# EAGLE schematic H03R0-T (EAGLE 9.6.2)
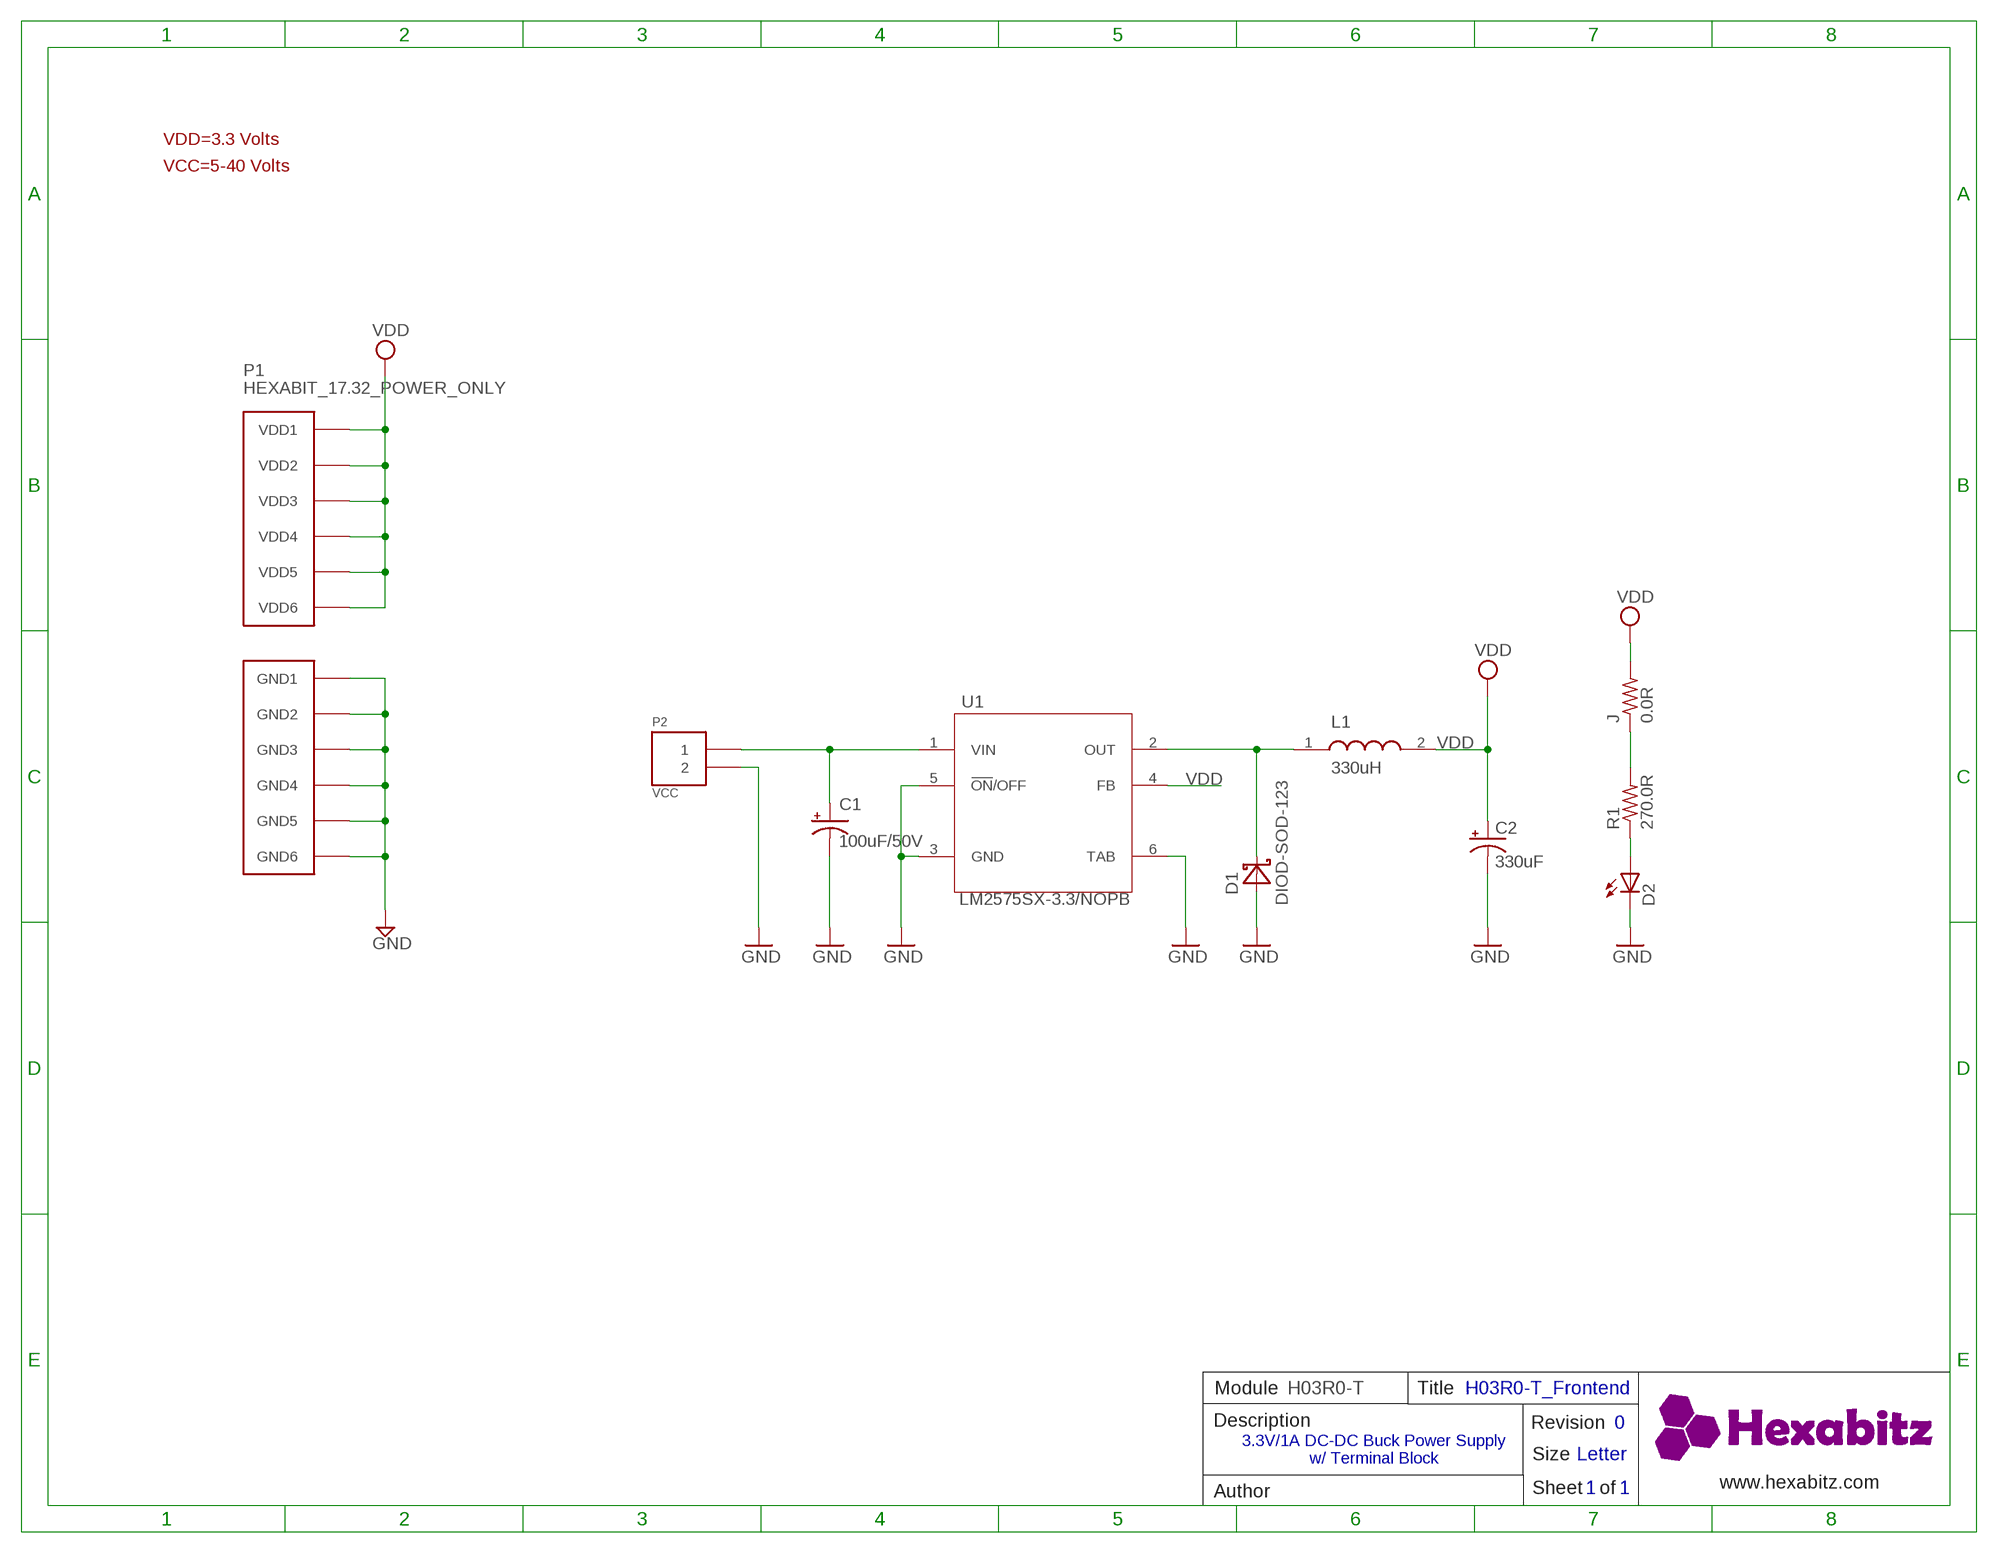
[diagram p0: schematic, sheet 1]

## Parts
C1  100uF/50V  CPOL-US  [E3,5-8]
C2  330uF  AVX-E  [CAPPM7343X200N]
D1  DIOD-SOD-123  [SOD123]
D2  VLMS1300-GS08  [VLMS1300-GS08]
J  0.0R  R-0603  [R-0603]
L1  330uH  SRR1280-331K  [SRR1280-150M]
P1  HEXABIT_17.32_POWER_ONLY  [HEXABIT_17.32_POWER_ONLY]
P2  VCC  1546111-2  [1546111-2]
R1  270.0R  R-0603  [R-0603]
U1  LM2575SX-3.3/NOPB  [TO170P1435X457-6N]

## Nets
GND: C1.- C2.2(-) D1.1(A) D2.C P1.PAD_PD7(GND1) P1.PAD_PD8(GND2) P1.PAD_PD9(GND3) P1.PAD_PD10(GND4) P1.PAD_PD11(GND5) P1.PAD_PD12(GND6) P2.2 U1.3(GND) U1.5(ON/OFF) U1.6(TAB)
N$1: C1.+ P2.1 U1.1(VIN)
N$2: D1.2(C) L1.1 U1.2(OUT)
N$3: D2.A R1.1
N$4: J.1 R1.2
VDD: C2.1(+) J.2 L1.2 P1.PAD_PU7(VDD1) P1.PAD_PU8(VDD2) P1.PAD_PU9(VDD3) P1.PAD_PU10(VDD4) P1.PAD_PU11(VDD5) P1.PAD_PU12(VDD6) U1.4(FB)

## Notes on the sheet
- VDD=3.3 Volts
- VCC=5-40 Volts
- Module | H03R0-T | Title | H03R0-T_Frontend
- Description | Revision | 0
- 3.3V/1A DC-DC Buck Power Supply
  w/ Terminal Block
- Size | Letter
- www.hexabitz.com
- Author | Sheet   of | 1 | 1
- C:/Users/Admin/Desktop/logodraft.bmp | C:/Users/Admin/Desktop/logodraft.bmp

## Library data of the parts
C1 = Hexabitz:CPOL-US: ELECTROLYTIC CAPACITOR grid 3.5 mm, diameter 8 mm; CAPACITANCE: 100F; CPACITANCE_RATING: ±20%; MFN: Nichicon; MPN: UVR1H101MPD1TD; OCTOPART_ID: 913e58b97f3b4ef9; OCTOPART_URL: http://octopart.com/uvr1h101mpd1td-nichicon-9292643; VOLTAGE_RATING_DC: 50.0 V
C2 = Hexabitz:AVX-E: Panasonic 330F SMD Solid Polymer Tantalum Capacitor, 6.3 V 20%, POSCAP Series Source: Datasheet <https://industrial.panasonic.com/cdbs/www-data/pdf/AAA8000/AAA8000C68.pdf>; DESCRIPTION: Panasonic 330F SMD Solid Polymer Tantalum Capacitor, 6.3 V 20%, POSCAP Series; HEIGHT: 2mm; MANUFACTURER_NAME: Panasonic; MANUFACTURER_PART_NUMBER: 6TPC330MA; MOUSER_PART_NUMBER: 667-6TPC330MA; MOUSER_PRICE-STOCK: https://www.mouser.com/Search/Refine.aspx?Keyword=667-6TPC330MA; RS_PART_NUMBER: 1666900; RS_PRICE-STOCK: http://uk.rs-online.com/web/p/products/1666900
D1 = Hexabitz:DIOD-SOD-123: 1.0 A Surface Mount Schottky Barrier Rectifier, 40 V, -65 to 125 degC, 2-Pin SOD-123 Package, RoHS, Tape and Reel; CAPACITANCE: 1.1e-10 F; CURRENT_RATING: 1.0 A; MFN: diodes; MPN: 1N5819HW-7-F; OCTOPART_ID: e83e2130232537f9; OCTOPART_URL: https://octopart.com/1n5819hw-7-f-diodes+inc.-323197; VOLTAGE_RATING_DC: 40.0 V
D2 = Hexabitz:VLMS1300-GS08: Red 0603 130° Clear 54 mcd 2 V Surface Mount ChipLED ; Octopart Url : http://octopart.com/vlms1300-gs08-vishay-21709201; MFN: Vishay; MPN: VLMTG1300-GS08; OCTOPART_URL: http://octopart.com/vlmtg1300-gs08-vishay-21709202
J = Hexabitz:R-0603: Thick Film Resistors - SMD 0603; MFN: Yageo; MPN: RC0603JR-070RL; OCTOPART_URL: https://octopart.com/crcw06030000z0eahp-vishay-44320230; RESISTANCE: 0.0 Ω
L1 = Hexabitz:SRR1280-331K: Bourns SRR1280 Series Shielded Wire-wound SMD Inductor with a Ferrite Core, 330 H 10% Wire-Wound 1.1A Idc Q:18 Source: Datasheet <https://www.bourns.com/docs/Product-Datasheets/SRR1280.pdf>; ALLIED_NUMBER: 70277079; ALLIED_PRICE-STOCK: https://www.alliedelec.com/bourns-srr1280-331k/70277079/; DESCRIPTION: Bourns SRR1280 Series Shielded Wire-wound SMD Inductor with a Ferrite Core, 330 H 10% Wire-Wound 1.1A Idc Q:18; HEIGHT: mm; MANUFACTURER_NAME: Bourns; MANUFACTURER_PART_NUMBER: SRR1280-331K; MOUSER_PART_NUMBER: 652-SRR1280-331K; MOUSER_PRICE-STOCK: https://www.mouser.com/Search/Refine.aspx?Keyword=652-SRR1280-331K; RS_PART_NUMBER: 1728540; RS_PRICE-STOCK: http://uk.rs-online.com/web/p/products/1728540
P1 = hexabitz_connectors:HEXABIT_?_POWER_ONLY: Hexabitz Hexagon Module Connector Hexagon side length = 17.32mm. Power-only connector. All array ports are removed.
P2 = Hexabitz:1546111-2: Conn Shrouded Header HDR 2 POS 5.08mm Solder ST Thru-Hole; MFN: TE Connectivity; MPN: 1546111-2; OCTOPART_URL: https://octopart.com/1546111-2-te+connectivity-40393355
R1 = Hexabitz:R-0603: Thick Film Resistors - SMD 0603; MFN: Yageo; MPN: RC0603FR-07270RL; OCTOPART_URL: https://octopart.com/crcw0603270rjnea-vishay-39784736; RESISTANCE: 270.0 Ω; TOLERANCE: ±5%
U1 = Hexabitz:LM2575SX-3.3/NOPB: Step-Down Voltage Regulator; DESCRIPTION: Conv DC-DC 4V to 40V Step Down Single-Out 3.3V 1A 6-Pin_5+Tab_ TO-263 T/R; DIGI-KEY_PART_NUMBER: LM2575SX-3.3/NOPBCT-ND; DIGI-KEY_PURCHASE_URL: https://www.digikey.com/product-detail/en/texas-instruments/LM2575SX-3.3-NOPB/LM2575SX-3.3-NOPBCT-ND/3526855?utm_source=snapeda&utm_medium=aggregator&utm_campaign=symbol; MF: Texas Instruments; MP: LM2575SX-3.3/NOPB; PACKAGE: TO-263-6 Texas Instruments